# Altium schematic sheet audio.SchDoc
size A4
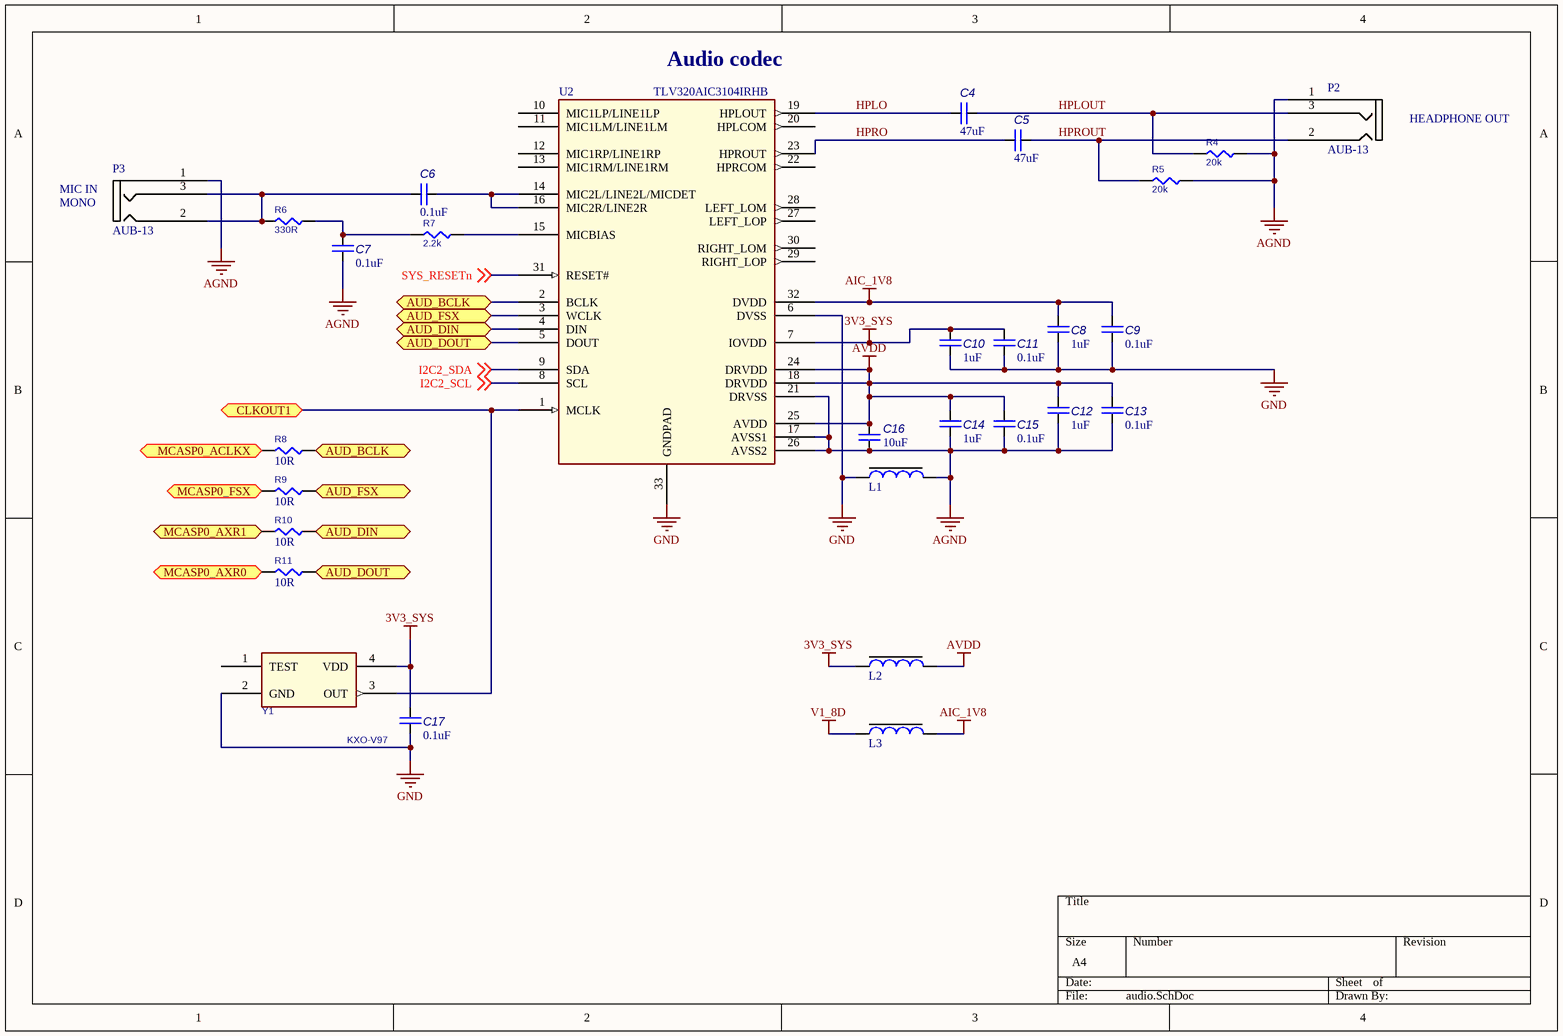
[diagram p0: audio.SchDoc]

## Parts
C4  value 47uF  [CC3216-1206]  (hidden comment: C1206)
C5  value 47uF  [CC3216-1206]  (hidden comment: C1206)
C6  value 0.1uF  [CC1608-0603]  (hidden comment: C0603)
C7  value 0.1uF  [CC1608-0603]  (hidden comment: C0603)
C8  value 1uF  [CC1608-0603]  (hidden comment: C0603)
C9  value 0.1uF  [CC1608-0603]  (hidden comment: C0603)
C10  value 1uF  [CC1608-0603]  (hidden comment: C0603)
C11  value 0.1uF  [CC1608-0603]  (hidden comment: C0603)
C12  value 1uF  [CC1608-0603]  (hidden comment: C0603)
C13  value 0.1uF  [CC1608-0603]  (hidden comment: C0603)
C14  value 1uF  [CC1608-0603]  (hidden comment: C0603)
C15  value 0.1uF  [CC1608-0603]  (hidden comment: C0603)
C16  value 10uF  [CC2012-0805]  (hidden comment: C0805)
C17  value 0.1uF  [CC1608-0603]  (hidden comment: C0603)
L1  BLM21  [CC2012-0805]  (value not drawn)
L2  BLM21  [CC2012-0805]  (value not drawn)
L3  BLM21  [CC2012-0805]  (value not drawn)
P2  AUB-13  [AUB_13]
P3  AUB-13  [AUB_13]
R4  value 20k  [CHIP0603]  (hidden comment: R0603)
R5  value 20k  [CHIP0603]  (hidden comment: R0603)
R6  value 330R  [CHIP0603]  (hidden comment: R0603)
R7  value 2.2k  [CHIP0603]  (hidden comment: R0603)
R8  value 10R  [RESC1608X55N]  (hidden comment: R0603)
R9  value 10R  [RESC1608X55N]  (hidden comment: R0603)
R10  value 10R  [RESC1608X55N]  (hidden comment: R0603)
R11  value 10R  [RESC1608X55N]  (hidden comment: R0603)
U2  Man P/N: TLV320AIC3104IRHB  [QFN5X5-32]  (hidden comment: TLV320AIC3104)
Y1  KXO-V97  [KXO_V97]

## Ports
AUD_BCLK, AUD_DIN, AUD_DOUT, AUD_FSX, CLKOUT1, MCASP0_ACLKX, MCASP0_AXR0, MCASP0_AXR1, MCASP0_FSX

## Nets
3V3_SYS: C10.1 C11.1 C17.1 L2.1 U2.7(IOVDD) Y1.4(VDD)
AGND: C7.1 C12.2 C13.2 C14.2 C15.2 C16.1 L1.2 P2.1(GND) P3.1(GND) R4.1 R5.1 U2.17(AVSS1) U2.21(DRVSS) U2.26(AVSS2)
AIC_1V8: C8.1 C9.1 L3.2 U2.32(DVDD)
AVDD: C12.1 C13.1 C14.1 C15.1 C16.2 L2.2 U2.18(DRVDD) U2.24(DRVDD) U2.25(AVDD)
GND: C8.2 C9.2 C10.2 C11.2 C17.2 L1.1 U2.6(DVSS) U2.33(GNDPAD) Y1.2(GND)
V1_8D: L3.1
AUD_BCLK: R8.2 U2.2(BCLK) ; port AUD_BCLK
AUD_DIN: R10.2 U2.4(DIN) ; port AUD_DIN
AUD_DOUT: R11.2 U2.5(DOUT) ; port AUD_DOUT
AUD_FSX: R9.2 U2.3(WCLK) ; port AUD_FSX
CLKOUT1: U2.1(MCLK) Y1.3(OUT) ; port CLKOUT1
HPLO: C4.2 U2.19(HPLOUT)
HPLOUT: C4.1 P2.3(LEFT) R4.2
HPRO: C5.2 U2.23(HPROUT)
HPROUT: C5.1 P2.2(RIGHT) R5.2
I2C2_SCL: U2.8(SCL) ; off-sheet I2C2_SCL
I2C2_SDA: U2.9(SDA) ; off-sheet I2C2_SDA
MCASP0_ACLKX: R8.1 ; port MCASP0_ACLKX
MCASP0_AXR0: R11.1 ; port MCASP0_AXR0
MCASP0_AXR1: R10.1 ; port MCASP0_AXR1
MCASP0_FSX: R9.1 ; port MCASP0_FSX
SYS_RESETn: U2.31(RESET#) ; off-sheet SYS_RESETn
NetC6_1: C6.1 P3.2(RIGHT) P3.3(LEFT) R6.1
NetC6_2: C6.2 U2.14(MIC2L/LINE2L/MICDET) U2.16(MIC2R/LINE2R)
NetC7_2: C7.2 R6.2 R7.1
NetR7_2: R7.2 U2.15(MICBIAS)

Not connected (* = marked no-connect by the designer): U2 10(MIC1LP/LINE1LP) 11(MIC1LM/LINE1LM) 12(MIC1RP/LINE1RP) 13(MIC1RM/LINE1RM) 20(HPLCOM) 22(HPRCOM) 27(LEFT_LOP) 28(LEFT_LOM) 29(RIGHT_LOP) 30(RIGHT_LOM); Y1 1(TEST)

## Notes on the sheet
- (near U2) Audio codec
- HEADPHONE OUT
- MIC IN
  MONO

## Library data of the parts
L1-L3 = BLM21: Ferrite bead; Manufacturer: Murata; P/N: BLM21AG601SN1D; Package: 0805
P2 P3 = AUB-13: Audio connector mini-jack 3.5mm, 3 pins; Vendor: brownbear.ru
R4-R7 = R0603: Resistor 0603
U2 = TLV320AIC3104: LOW-POWER STEREO AUDIO CODEC FOR PORTABLE AUDIO/TELEPHONY; Manufacturer: TI
Y1 = KXO-V97: Quartz oscillator 7x5mm; Manufacturer: Geyer; Value: 12MHz; Man P/N: KXO-V97
C4 C5 = C1206: P/N: *
C6-C15 C17 = C0603: P/N: *
C16 = C0805: P/N: *
R8-R11 = R0603: P/N: *